# EAGLE design HelpfulHallway (EAGLE 9.5.0)
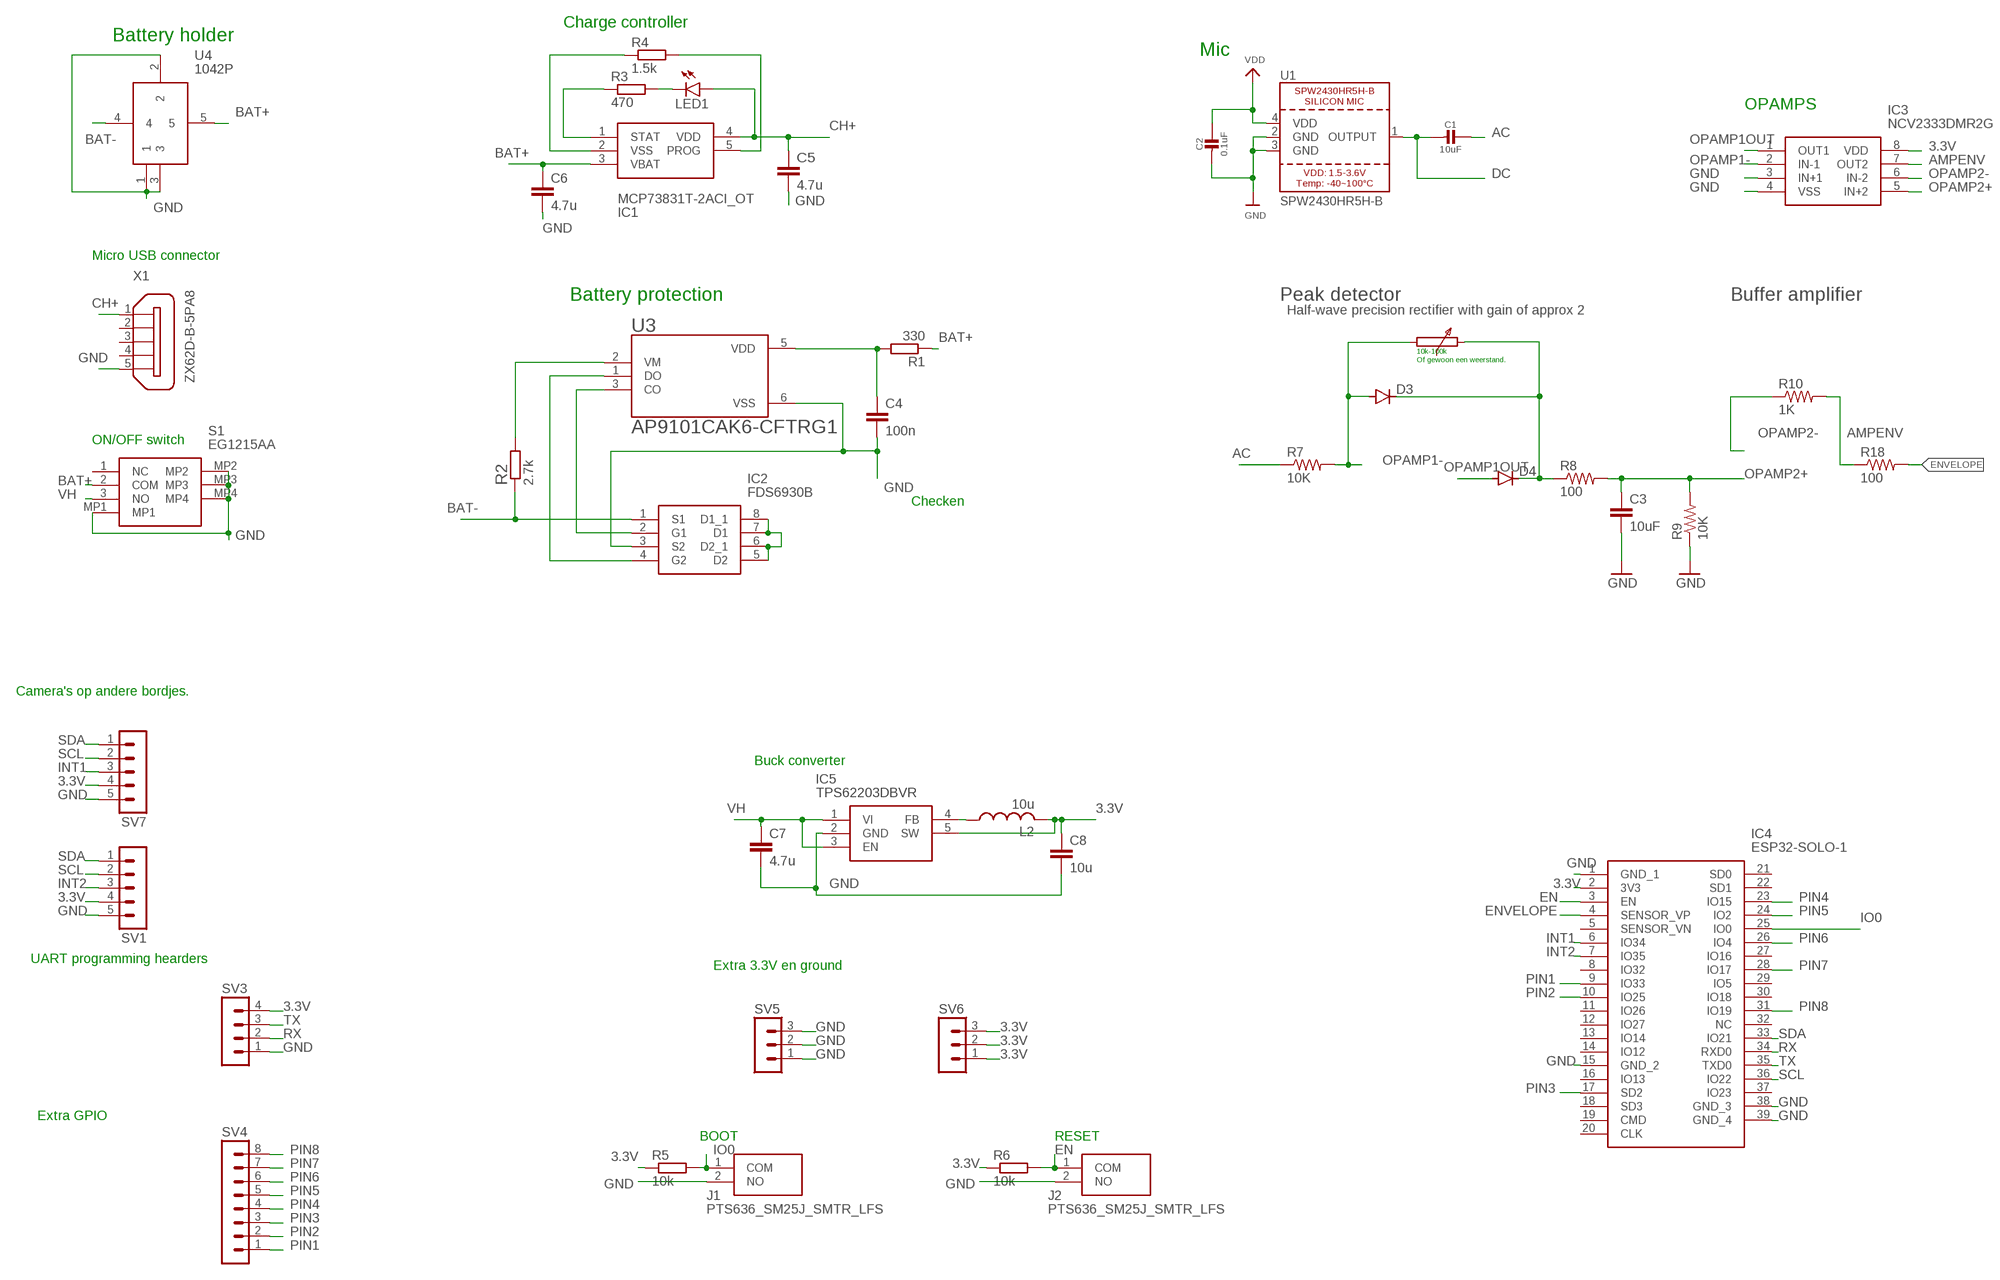
[diagram p0: schematic, sheet 1]

## Parts
C1  10uF  CAP_CERAMIC0805-NOOUTLINE  [0805-NO]
C2  0.1uF  CAP_CERAMIC0805-NOOUTLINE  [0805-NO]
C3  10uF  10UF-6.3V-20%(1206)  [1206]
C4  100n  C-EUC1206  [C1206]
C5  4.7u  C-EUC1206  [C1206]
C6  4.7u  C-EUC1206  [C1206]
C7  4.7u  C-EUC1206  [C1206]
C8  10u  C-EUC1206  [C1206]
D3  DIODE-SOD123  [SOD123]
D4  DIODE-SOD123  [SOD123]
IC1  MCP73831T-2ACI_OT  [SOT95P270X145-5N]
IC2  FDS6930B  [SOIC127P600X175-8N]
IC3  NCV2333DMR2G  [SOP65P490X110-8N]
IC4  ESP32-SOLO-1  [ESP32SOLO1]
IC5  TPS62203DBVR  [SOT95P280X145-5N]
J1  PTS636_SM25J_SMTR_LFS  [PTS636SM25JSMTRLFS]
J2  PTS636_SM25J_SMTR_LFS  [PTS636SM25JSMTRLFS]
L2  10u  L-USL4532P  [L4532P]
LED1  LEDSMT1206  [1206]
R1  330  R-EU_R1206  [R1206]
R2  2.7k  R-EU_R1206  [R1206]
R3  470  R-EU_R1206  [R1206]
R4  1.5k  R-EU_R1206  [R1206]
R5  10k  R-EU_M1206  [M1206]
R6  10k  R-EU_M1206  [M1206]
R7  10K  10KOHM1/10W1%(0603)0603  [0603-RES]
R8  100  100OHM1/10W1%(0603)  [0603-RES]
R9  10K  10KOHM1/10W1%(0603)0603  [0603-RES]
R10  1K  1KOHM1/10W1%(0603)  [0603-RES]
R18  100  100OHM1/10W1%(0603)  [0603-RES]
S1  EG1215AA  [EG1215AA]
SV1  MA05-1  [MA05-1]
SV3  MA04-1  [MA04-1]
SV4  MA08-1  [MA08-1]
SV5  MA03-1  [MA03-1]
SV6  MA03-1  [MA03-1]
SV7  MA05-1  [MA05-1]
U1  SPW2430HR5H-B  [SPW2430HR5H-B]
U3  AP9101CAK6-CFTRG1  [SOT95P280X140-6N]
U4  1042P  [1042P]
X1  ZX62D-B-5PA8  [ZX62D-B-5PA8]

## Nets
3.3V: C8.1 IC3.8(VDD) IC4.2(3V3) IC5.5(SW) L2.2 R5.1 R6.1 SV1.4 SV3.4 SV6.1 SV6.2 SV6.3 SV7.4
AC: C1.1 R7.1
AMPENV: IC3.7(OUT2) R10.2 R18.1
BAT+: C6.1 IC1.3(VBAT) R1.1 S1.2(COM) U4.5
BAT-: IC2.1(S1) R2.1 U4.4
CH+: C5.1 IC1.4(VDD) LED1.A X1.1
DC: C1.2 U1.1(OUTPUT)
EN: IC4.3(EN) J2.1(COM) R6.2
ENVELOPE: IC4.4(SENSOR_VP) R18.2
GND: C2.2 C3.2 C4.2 C5.2 C6.2 C7.2 C8.2 IC2.3(S2) IC3.3(IN+1) IC3.4(VSS) IC4.1(GND_1) IC4.15(GND_2) IC4.38(GND_3) IC4.39(GND_4) IC5.2(GND) J1.2(NO) J2.2(NO) R9.1 S1.MP1 S1.MP2 S1.MP3 S1.MP4 SV1.5 SV3.1 SV5.1 SV5.2 SV5.3 SV7.5 U1.2(GND) U1.3(GND) U3.6(VSS) U4.1 U4.2 U4.3 X1.5
INT1: IC4.6(IO34) SV7.3
INT2: IC4.7(IO35) SV1.3
IO0: IC4.25(IO0) J1.1(COM) R5.2
N$1: R2.2 U3.2(VM)
N$4: IC2.5(D2) IC2.6(D2_1) IC2.7(D1) IC2.8(D1_1)
N$5: IC2.4(G2) U3.1(DO)
N$6: IC2.2(G1) U3.3(CO)
N$9: LED1.C R3.2
N$10: C4.1 R1.2 U3.5(VDD)
N$11: D3.C D4.C R8.1
N$12: IC1.1(STAT) R3.1
N$14: IC5.4(FB) L2.1
N$17: IC1.5(PROG) R4.2
N$18: IC1.2(VSS) R4.1
OPAMP1-: D3.A IC3.2(IN-1) R7.2
OPAMP1OUT: D4.A IC3.1(OUT1)
OPAMP2+: C3.1 IC3.5(IN+2) R8.2 R9.2
OPAMP2-: IC3.6(IN-2) R10.1
PIN1: IC4.9(IO33) SV4.1
PIN2: IC4.10(IO25) SV4.2
PIN3: IC4.17(SD2) SV4.3
PIN4: IC4.23(IO15) SV4.4
PIN5: IC4.24(IO2) SV4.5
PIN6: IC4.26(IO4) SV4.6
PIN7: IC4.28(IO17) SV4.7
PIN8: IC4.31(IO19) SV4.8
RX: IC4.34(RXD0) SV3.2
SCL: IC4.36(IO22) SV1.2 SV7.2
SDA: IC4.33(IO21) SV1.1 SV7.1
TX: IC4.35(TXD0) SV3.3
VDD: C2.1 U1.4(VDD)
VH: C7.1 IC5.1(VI) IC5.3(EN) S1.3(NO)
Unconnected: IC4.5(SENSOR_VN) IC4.8(IO32) IC4.11(IO26) IC4.12(IO27) IC4.13(IO14) IC4.14(IO12) IC4.16(IO13) IC4.18(SD3) IC4.19(CMD) IC4.20(CLK) IC4.21(SD0) IC4.22(SD1) IC4.27(IO16) IC4.29(IO5) IC4.30(IO18) IC4.32(NC) IC4.37(IO23) S1.1(NC) X1.2 X1.3 X1.4 X1.S1 X1.S2 X1.S3 X1.S4

## Notes on the sheet
- Charge controller
- Battery holder
- Mic
- OPAMPS
- Micro USB connector
- Battery protection | Peak detector | Buffer amplifier
- Half-wave precision rectifier with gain of approx 2
- 10k-100k
  Of gewoon een weerstand.
- ON/OFF switch
- Checken
- Camera's op andere bordjes.
- Buck converter
- UART programming hearders
- Extra 3.3V en ground
- Extra GPIO
- BOOT | RESET

## Library data of the parts
C1 C2 = microbuilder:CAP_CERAMIC: Ceramic Capacitors For new designs, use the packages preceded by an '_' character since they are more reliable: The following footprints should be used on most boards: _0402 - Standard footprint for regular board layouts _0603 - Standard footprint for regular board layouts _0805 - Standard footprint for regular board layouts _1206 - Standard footprint for regular board layouts For extremely tight-pitch boards where space is at a premium, the following 'micro-pitch' footprints can be used (smaller pads, no silkscreen outline, etc.): _0402MP - Micro-pitch footprint for very dense/compact boards _0603MP - Micro-pitch footprint for very dense/compact boards _0805MP - Micro-pitch footprint for very dense/compact boards _1206MP - Micro-pitch footprint for very dense/compact boards
C3 = SparkFun-Capacitors:10UF-6.3V-20%(1206): Ceramic CAP-10057; PROD_ID: CAP-10057
C4-C8 = rcl:C-EU: CAPACITOR, European symbol; SPICEPREFIX: C
D3 D4 = diode:DIODE-: DIODE
IC1 = SamacSys_Parts:MCP73831T-2ACI_OT: Li-Ion Charge Controller 4.2V SOT23-5 Source: Datasheet <https://componentsearchengine.com/Datasheets/1/MCP73831T-2ACI_OT.pdf>; DESCRIPTION: Li-Ion Charge Controller 4.2V SOT23-5; HEIGHT: 1.45mm; MANUFACTURER_NAME: Microchip; MANUFACTURER_PART_NUMBER: MCP73831T-2ACI/OT; MOUSER_PART_NUMBER: 579-MCP73831T-2ACIOT; MOUSER_PRICE-STOCK: https://www.mouser.com/Search/Refine.aspx?Keyword=579-MCP73831T-2ACIOT
IC2 = SamacSys_Parts:FDS6930B: FDS6930B, Dual N-channel MOSFET Transistor 5.5A 30V, 8-Pin SOIC Source: Datasheet <https://componentsearchengine.com/Datasheets/1/FDS6930B.pdf>; DESCRIPTION: FDS6930B, Dual N-channel MOSFET Transistor 5.5A 30V, 8-Pin SOIC; HEIGHT: 1.75mm; MANUFACTURER_NAME: ON Semiconductor; MANUFACTURER_PART_NUMBER: FDS6930B; MOUSER_PART_NUMBER: 512-FDS6930B; MOUSER_PRICE-STOCK: https://www.mouser.com/Search/Refine.aspx?Keyword=512-FDS6930B
IC3 = SamacSys_Parts:NCV2333DMR2G: DUAL PRECISION OP-AMP Source: Datasheet <https://componentsearchengine.com/Datasheets/1/NCV2333DMR2G.pdf>; DESCRIPTION: DUAL PRECISION OP-AMP; HEIGHT: 1.1mm; MANUFACTURER_NAME: ON Semiconductor; MANUFACTURER_PART_NUMBER: NCV2333DMR2G; MOUSER_PART_NUMBER: 863-NCV2333DMR2G; MOUSER_PRICE-STOCK: https://www.mouser.com/Search/Refine.aspx?Keyword=863-NCV2333DMR2G
IC4 = SamacSys_Parts:ESP32-SOLO-1: WiFi Modules (802.11) SMD Module, ESP32-S0WD, 32Mbits SPI flash, UART mode, Source: Datasheet <https://componentsearchengine.com/Datasheets/1/ESP32-SOLO-1.pdf>; DESCRIPTION: WiFi Modules (802.11) SMD Module, ESP32-S0WD, 32Mbits SPI flash, UART mode,; HEIGHT: mm; MANUFACTURER_NAME: Espressif Systems; MANUFACTURER_PART_NUMBER: ESP32-SOLO-1; MOUSER_PART_NUMBER: 356-ESP32-SOLO-1; MOUSER_PRICE-STOCK: https://www.mouser.com/Search/Refine.aspx?Keyword=356-ESP32-SOLO-1
IC5 = SamacSys_Parts:TPS62203DBVR: 3.3-V Output, 300-mA, 95% Efficient Step-Down Converter in SOT-23 Source: Datasheet <http://www.ti.com/lit/ds/symlink/tps62203.pdf>; DESCRIPTION: 3.3-V Output, 300-mA, 95% Efficient Step-Down Converter in SOT-23; HEIGHT: 1.45mm; MANUFACTURER_NAME: Texas Instruments; MANUFACTURER_PART_NUMBER: TPS62203DBVR; MOUSER_PART_NUMBER: 595-TPS62203DBVR; MOUSER_PRICE-STOCK: https://www.mouser.com/Search/Refine.aspx?Keyword=595-TPS62203DBVR
J1 J2 = SamacSys_Parts:PTS636_SM25J_SMTR_LFS: Tactile Switches Tact 50mA 12VDC, 6.0x3.5, 2.5mm H, 180gf, J leads, No ground pin, White Actuator Source: Datasheet <https://componentsearchengine.com/Datasheets/1/PTS636 SM25J SMTR LFS.pdf>; DESCRIPTION: Tactile Switches Tact 50mA 12VDC, 6.0x3.5, 2.5mm H, 180gf, J leads, No ground pin, White Actuator; HEIGHT: 2.7mm; MANUFACTURER_NAME: C & K COMPONENTS; MANUFACTURER_PART_NUMBER: PTS636 SM25J SMTR LFS; MOUSER_PART_NUMBER: 611-PTS636SM25JSMTRL; MOUSER_PRICE-STOCK: https://www.mouser.com/Search/Refine.aspx?Keyword=611-PTS636SM25JSMTRL
L2 = rcl:L-US: INDUCTOR, American symbol; SPICEPREFIX: L
LED1 = led:LED: LED OSRAM: - CHIPLED LG R971, LG N971, LY N971, LG Q971, LY Q971, LO R971, LY R971 LH N974, LH R974 LS Q976, LO Q976, LY Q976 LO Q996 - Hyper CHIPLED LW Q18S LB Q993, LB Q99A, LB R99A - SideLED LS A670, LO A670, LY A670, LG A670, LP A670 LB A673, LV A673, LT A673, LW A673 LH A674 LY A675 LS A676, LA A676, LO A676, LY A676, LW A676 LS A679, LY A679, LG A679 - Hyper Micro SIDELED® LS Y876, LA Y876, LO Y876, LY Y876 LT Y87S - SmartLED LW L88C, LW L88S LB L89C, LB L89S, LG L890 LS L89K, LO L89K, LY L89K LS L896, LA L896, LO L896, LY L896 - TOPLED LS T670, LO T670, LY T670, LG T670, LP T670 LSG T670, LSP T670, LSY T670, LOP T670, LYG T670 LG T671, LOG T671, LSG T671 LB T673, LV T673, LT T673, LW T673 LH T674 LS T676, LA T676, LO T676, LY T676, LB T676, LH T676, LSB T676, LW T676 LB T67C, LV T67C, LT T67C, LS T67K, LO T67K, LY T67K, LW E67C LS E67B, LA E67B, LO E67B, LY E67B, LB E67C, LV E67C, LT E67C LW T67C LS T679, LY T679, LG T679 LS T770, LO T770, LY T770, LG T770, LP T770 LB T773, LV T773, LT T773, LW T773 LH T774 LS E675, LA E675, LY E675, LS T675 LS T776, LA T776, LO T776, LY T776, LB T776 LHGB T686 LT T68C, LB T68C - Hyper Mini TOPLED® LB M676 - Mini TOPLED Santana® LG M470 LS M47K, LO M47K, LY M47K Source: http://www.osram.convergy.de LUXEON: - LUMILED® LXK2-PW12-R00, LXK2-PW12-S00, LXK2-PW14-U00, LXK2-PW14-V00 LXK2-PM12-R00, LXK2-PM12-S00, LXK2-PM14-U00 LXK2-PE12-Q00, LXK2-PE12-R00, LXK2-PE12-S00, LXK2-PE14-T00, LXK2-PE14-U00 LXK2-PB12-K00, LXK2-PB12-L00, LXK2-PB12-M00, LXK2-PB14-N00, LXK2-PB14-P00, LXK2-PB14-Q00 LXK2-PR12-L00, LXK2-PR12-M00, LXK2-PR14-Q00, LXK2-PR14-R00 LXK2-PD12-Q00, LXK2-PD12-R00, LXK2-PD12-S00 LXK2-PH12-R00, LXK2-PH12-S00 LXK2-PL12-P00, LXK2-PL12-Q00, LXK2-PL12-R00 Source: www.luxeon.com KINGBRIGHT: KA-3528ASYC Source: www.kingbright.com
R1-R3 = resistor:R-EU_: RESISTOR, European symbol
R4-R6 = rcl:R-EU_: RESISTOR, European symbol; SPICEPREFIX: R
R7 R9 = SparkFun-Resistors:10KOHM1/10W1%(0603): RES-00824; PROD_ID: RES-00824
R8 R18 = SparkFun-Resistors:100OHM1/10W1%(0603): RES-07863; PROD_ID: RES-07863
R10 = SparkFun-Resistors:1KOHM1/10W1%(0603): RES-07856; PROD_ID: RES-07856
S1 = SamacSys_Parts:EG1215AA: E-SWITCH - EG1215AA - SLIDE SWITCH, SPDT, 0.025A, 24V, SMD Source: Datasheet <https://componentsearchengine.com/Datasheets/1/EG1215AA.pdf>; DESCRIPTION: E-SWITCH - EG1215AA - SLIDE SWITCH, SPDT, 0.025A, 24V, SMD; HEIGHT: 1.4mm; MANUFACTURER_NAME: E-Switch; MANUFACTURER_PART_NUMBER: EG1215AA; MOUSER_PART_NUMBER: 612-EG1215AA; MOUSER_PRICE-STOCK: https://www.mouser.com/Search/Refine.aspx?Keyword=612-EG1215AA
SV1 SV7 = con-lstb:MA05-1: PIN HEADER; OC_FARNELL: unknown; OC_NEWARK: unknown
SV3 = con-lstb:MA04-1: PIN HEADER; OC_FARNELL: unknown; OC_NEWARK: unknown
SV4 = con-lstb:MA08-1: PIN HEADER; OC_FARNELL: unknown; OC_NEWARK: unknown
SV5 SV6 = con-lstb:MA03-1: PIN HEADER; OC_FARNELL: unknown; OC_NEWARK: unknown
U1 = microbuilder:SPW2430HR5H-B: SPW2430HR5H-B - Silicon Microphone
U3 = AP9101CAK6-CFTRG1:AP9101CAK6-CFTRG1: Ic Batt Prot Li-Ion 1-Cell Sot26; AVAILABILITY: Unavailable; DESCRIPTION: Battery Battery Protection IC Lithium Ion/Polymer SOT-26; MF: Diodes Inc.; MP: AP9101CAK6-CFTRG1; PACKAGE: SOT-23 Diodes Inc.; PRICE: None
U4 = SamacSys_Parts:1042P: KEYSTONE - 1042P - BATTERY HOLDER, 18650, SMD Source: Datasheet <https://componentsearchengine.com/Datasheets/1/1042P.pdf>; DESCRIPTION: KEYSTONE - 1042P - BATTERY HOLDER, 18650, SMD; HEIGHT: 14mm; MANUFACTURER_NAME: Keystone Electronics; MANUFACTURER_PART_NUMBER: 1042P; MOUSER_PART_NUMBER: 534-1042P; MOUSER_PRICE-STOCK: https://www.mouser.com/Search/Refine.aspx?Keyword=534-1042P
X1 = ZX62D-B-5PA8:ZX62D-B-5PA8: Micro USB Type B Connector - Standard, Shell Through Hole Source: http://www.hirose.co.jp/cataloge_hp/ed_ZX_20140804.pdf; AVAILABILITY: Unavailable; DESCRIPTION: USB - micro B USB 2.0 Receptacle Connector 5 Position Surface Mount, Right Angle; Through Hole; MF: Hirose; MP: ZX62D-B-5PA8; PACKAGE: None; PRICE: None

## Board
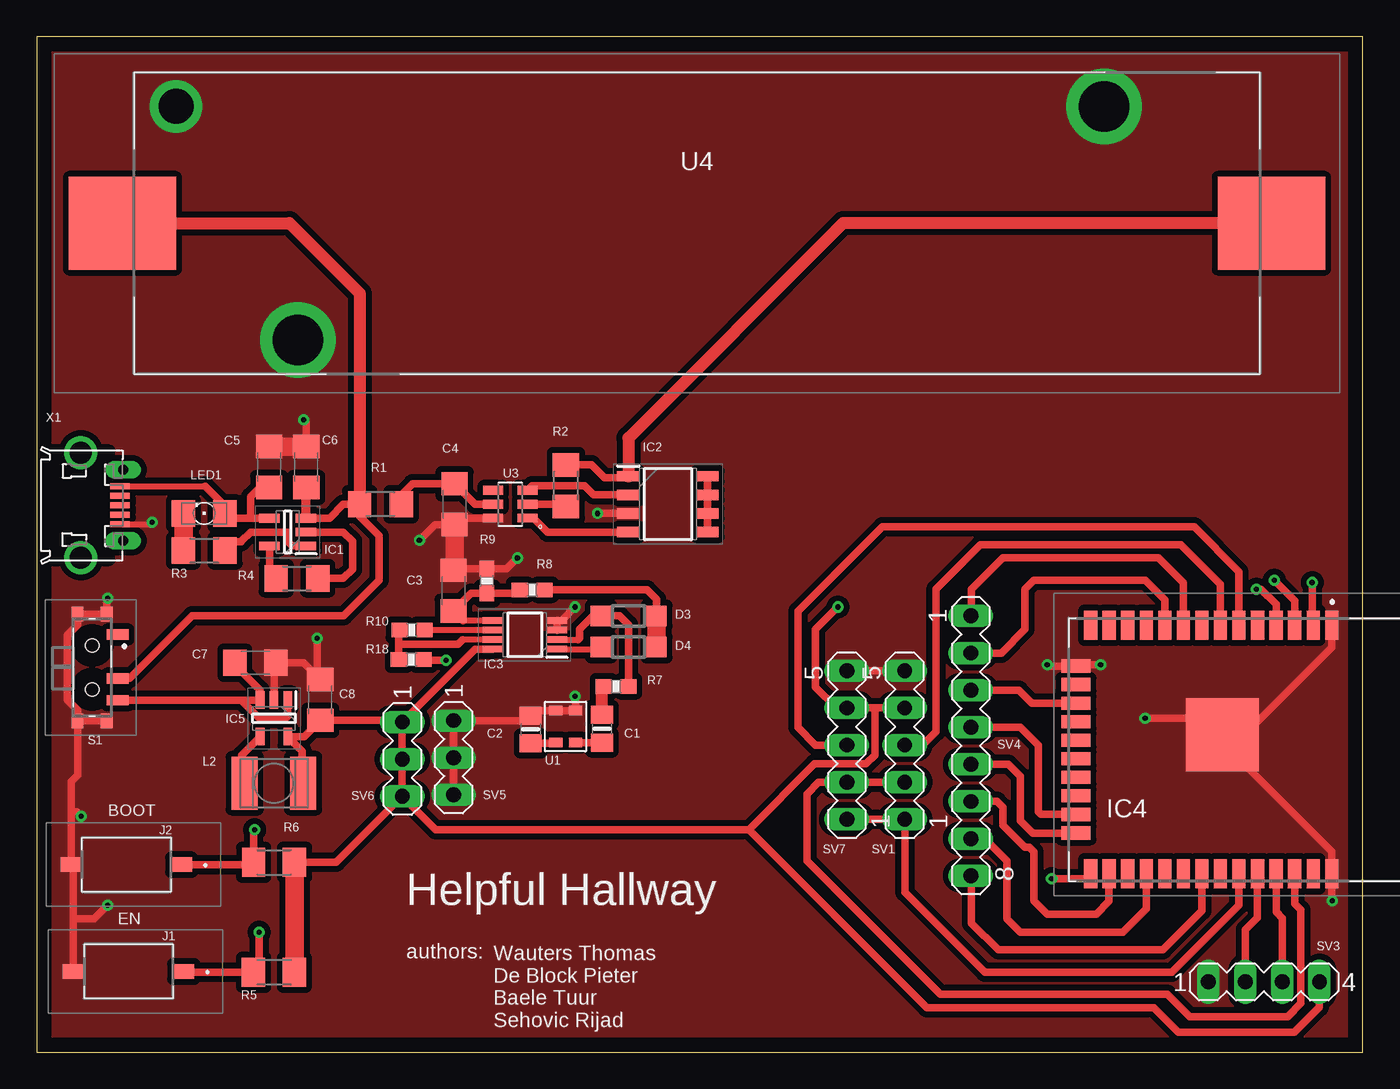
[diagram p1: board, top side]
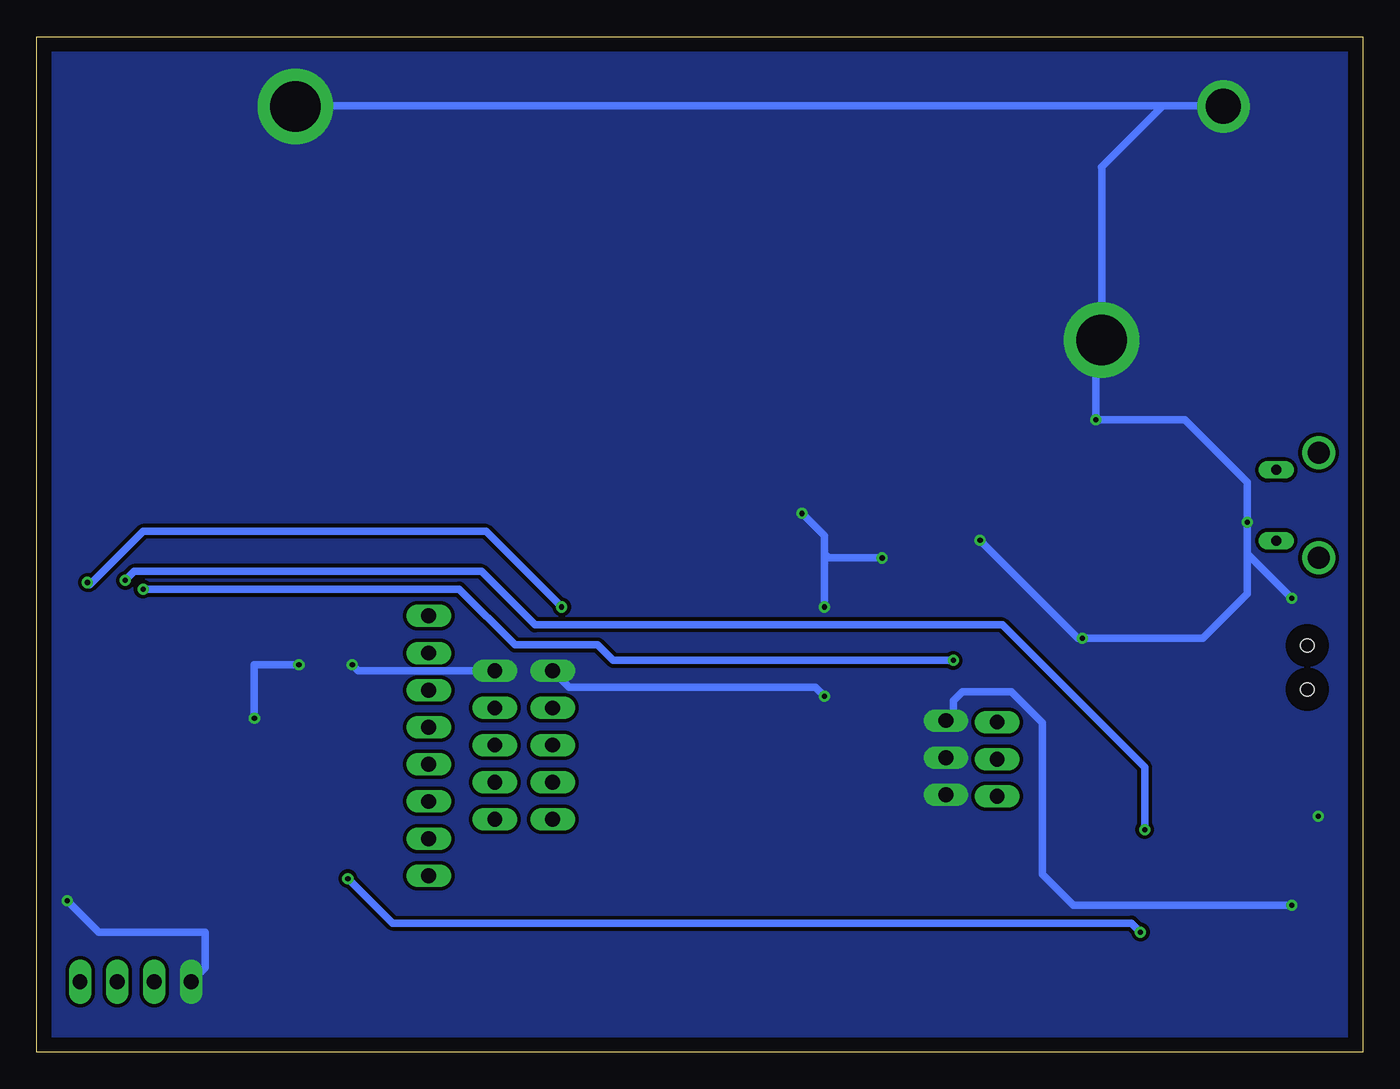
[diagram p2: board, bottom side, seen from below]

Size 90.81 x 69.52 mm. Coordinates in mm from the lower left corner, seen from the top.
Outline: 0,0 90.81,0 90.81,69.52 0,69.52 0,0
Copper layers (1*16): Top 0.035mm / dielectric 1.5mm / Bottom 0.035mm
Design rules "default *": minimum track width 6mil, minimum drill 0.35mm, track to track 6mil, track to pad 6mil, pad to pad 6mil, via to via 6mil, smd to smd 6mil, copper to edge 40mil, drill to drill 6mil, minimum pad ring 10mil, minimum via ring 8mil, stop-mask expansion 4mil, vias tented up to drill 0mil, thermal gap 10mil

### Footprints (pad centres in the part's own frame; a part is rotated, then mirrored left to right if it is on the bottom)
0805-NO = smd 1.24 x 1.5: 1 -0.95,0; 2 0.95,0
1206 = smd 1.6 x 1.8: 1 -1.4,0; 2 1.4,0
C1206 = smd 1.6 x 1.8: 1 -1.4,0; 2 1.4,0
SOD123 = smd 1.4 x 1.4: A 1.9,0; C -1.9,0
SOT95P270X145-5N = smd 1.4 x 0.6: 1 -1.25,0.95; 2 -1.25,0; 3 -1.25,-0.95; 4 1.25,-0.95; 5 1.25,0.95
SOIC127P600X175-8N = smd 1.525 x 0.7: 1 -2.712,1.905; 2 -2.712,0.635; 3 -2.712,-0.635; 4 -2.712,-1.905; 5 2.712,-1.905; 6 2.712,-0.635; 7 2.712,0.635; 8 2.712,1.905
SOP65P490X110-8N = smd 1.4 x 0.45: 1 -2.2,0.975; 2 -2.2,0.325; 3 -2.2,-0.325; 4 -2.2,-0.975; 5 2.2,-0.975; 6 2.2,-0.325; 7 2.2,0.325; 8 2.2,0.975
ESP32SOLO1 = smd 2 x 0.9: 1 -8.5,5.51; 2 -8.5,4.24; 3 -8.5,2.97; 4 -8.5,1.7; 5 -8.5,0.43; 6 -8.5,-0.84; 7 -8.5,-2.11; 8 -8.5,-3.38; 9 -8.5,-4.65; 10 -8.5,-5.92; 11 -8.5,-7.19; 12 -8.5,-8.46; 13 -8.5,-9.73; 14 -8.5,-11; 25 8.5,-11; 26 8.5,-9.73; 27 8.5,-8.46; 28 8.5,-7.19; 29 8.5,-5.92; 30 8.5,-4.65; 31 8.5,-3.38; 32 8.5,-2.11; 33 8.5,-0.84; 34 8.5,0.43; 35 8.5,1.7; 36 8.5,2.97; 37 8.5,4.24; 38 8.5,5.51 | smd 0.9 x 2: 15 -5.715,-12; 16 -4.445,-12; 17 -3.175,-12; 18 -1.905,-12; 19 -0.635,-12; 20 0.635,-12; 21 1.905,-12; 22 3.175,-12; 23 4.445,-12; 24 5.715,-12 | smd 5 x 5: 39 -1,-1.99
SOT95P280X145-5N = smd 1.2 x 0.6: 1 -1.25,0.95; 2 -1.25,0; 3 -1.25,-0.95; 4 1.25,-0.95; 5 1.25,0.95
PTS636SM25JSMTRLFS = smd 1.45 x 1: 1 -3.775,0; 2 3.775,0
L4532P = smd 1.8 x 3.6: 1 -2,0; 2 2,0
1206' = smd 1.6 x 1.803: A -1.422,0; C 1.422,0
R1206 = smd 1.6 x 1.803: 1 -1.422,0; 2 1.422,0
M1206 = smd 1.6 x 2: 1 -1.4,0; 2 1.4,0
0603-RES = smd 1.1 x 1: 1 -0.85,0; 2 0.85,0
EG1215AA = smd 0.7 x 1.5: 1 -2.25,1.75; 2 0.75,1.75; 3 2.25,1.75 | smd 1 x 0.8: MP1 -3.65,1; MP2 3.65,1; MP3 -3.65,-1; MP4 3.65,-1 | hole 0.9: -1.5,0; 1.5,0
MA05-1 = drill 1.016 long: 1 -5.08,0; 2 -2.54,0; 3 0,0; 4 2.54,0; 5 5.08,0
MA04-1 = drill 1.016 long: 1 -3.81,0; 2 -1.27,0; 3 1.27,0; 4 3.81,0
MA08-1 = drill 1.016 long: 1 -8.89,0; 2 -6.35,0; 3 -3.81,0; 4 -1.27,0; 5 1.27,0; 6 3.81,0; 7 6.35,0; 8 8.89,0
MA03-1 = drill 1.016 long: 1 -2.54,0; 2 0,0; 3 2.54,0
SPW2430HR5H-B = smd 0.9 x 0.66: 1 -0.675,1.095; 2 -0.675,-1.095; 3 0.675,-1.095; 4 0.675,1.095
SOT95P280X140-6N = smd 1.35 x 0.6: 1 -1.185,0.95; 2 -1.185,0; 3 -1.185,-0.95; 4 1.185,-0.95; 5 1.185,0; 6 1.185,0.95
1042P = drill 3.45 pad 5.175: 1 -27.87,-8; 2 27.33,8 | drill 2.39 pad 3.585: 3 35.66,-8 | smd 7.34 x 6.35: 4 -39.33,0; 5 39.33,0
ZX62D-B-5PA8 = smd 1.35 x 0.4: 1 4.825,1.3; 2 4.825,0.65; 3 4.825,0; 4 4.825,-0.65; 5 4.825,-1.3 | drill 1.5: S1 2.15,-3.6; S2 2.15,3.6 | drill 0.7 long: S3 5.05,2.425; S4 5.05,-2.425

### Placement (x,y rotation side)
C1  38.71,22.15 270 top
C2  33.83,22.1 90 top
C3  28.55,31.6 90 top
C4  28.63,37.52 270 top
C5  15.93,40.06 90 top
C6  18.47,40.06 90 top
C7  14.99,26.67 0 top
C8  19.43,24.13 90 top
D3  40.54,29.87 180 top
D4  40.54,27.74 180 top
IC1  17.2,35.61 180 top
IC2  43.23,37.52 0 top
IC3  33.43,28.57 180 top
IC4  83.16,20.73 270 top
IC5  16.26,22.86 270 top
J1  6.3,5.54 180 top
J2  6.16,12.85 180 top
L2  16.26,18.41 0 top
LED1  [1206']  11.48,36.88 180 top
R1  23.55,37.52 0 top
R2  36.25,38.79 270 top
R3  11.48,34.34 180 top
R4  17.83,32.44 180 top
R5  16.26,5.49 180 top
R6  16.26,13 180 top
R7  39.67,25.04 0 top
R8  33.93,31.65 180 top
R9  30.84,32.26 270 top
R10  25.7,28.91 180 top
R18  25.65,26.87 0 top
S1  3.81,26.34 270 top
SV1  59.44,21.03 90 top
SV3  84.02,4.83 0 top
SV4  63.96,20.98 270 top
SV5  28.55,20.17 270 top
SV6  25.04,20.07 270 top
SV7  55.47,21.03 90 top
U1  36.22,22.3 180 top
U3  32.44,37.52 180 top
U4  45.21,56.74 180 top
X1  0.89,37.44 0 top

### Tracks (layer width: path | path; a pad name or v marks a point on that pad's centre or on a via)
3.3V  (via drill 0.35)
  Top 0.508: L2.2 18.2,20.62 IC5.5 18.31,21.61 C8.1 24.92,22.73 SV6.1 | SV6.1 SV6.3 | 57.3,23.57 SV7.4 54.76,23.57 53.34,24.99 53.34,28.96 v54.86,30.48 | 57.3,23.57 SV1.4 | 17.66,5.48 R5.1 | SV6.1 30.04,27.6 IC3.8 | SV6.3 20.52,13.01 R6.1 | 57.3,23.57 57.4,23.47 57.4,20.55 57.39,20.53 57.39,20.34 56.79,19.74 53.27,19.74 48.77,15.24 | v87.33,32.16 87.33,29.3 IC4.2 | SV6.2 SV6.1 | SV3.4 87.83,3.1 86.12,1.39 78.16,1.39 76.5,3.05 60.96,3.05 48.77,15.24 | SV6.3 27.33,15.24 48.77,15.24
  Top 1.27: R6.1 17.66,5.48
  Bottom 0.508: v87.33,32.16 87.17,32 83.52,35.66 60.05,35.66 v54.86,30.48
AC
  Top 0.508: 38.71,24.93 R7.1
  Top 0.813: C1.1 38.71,24.93
AMPENV
  Top 0.406: IC3.7 29.16,28.25
  Top 0.508: R18.1 24.8,27.93 | 24.8,27.93 24.8,28.85 R10.2 | 24.8,27.93 28.85,27.93 29.16,28.25
BAT+
  Top 0.508: 18.47,36.58 IC1.3 20.05,36.56 21.01,37.52 R1.1 22.12,36.7 23.47,35.36 23.47,32.31 21.03,29.87 10.67,29.87 6.39,25.59 S1.2 | U4.5 6.1,56.96 6.1,57
  Top 0.61: 18.47,36.58 C6.1
  Top 0.813: U4.5 17.32,56.74 22.12,51.94 R1.1
BAT-
  Top 0.508: R2.1 38,40.21 38.89,39.32 40.62,39.32 IC2.1
  Top 0.813: U4.4 55.22,56.74 40.52,42.04 IC2.1
CH+
  Top 0.406: X1.1 11.55,38.74
  Top 0.508: IC1.4 14.66,36.56 | 14.66,36.56 13.22,36.56 LED1.A 12.9,37.39 11.55,38.74 | C5.1 15.29,38.66 14.66,38.02 14.66,36.56
DC
  Top 0.508: U1.1 C1.2
EN  (via drill 0.35)
  Top 0.508: J2.1 14.71,12.85 R6.2 14.87,15.17 v14.94,15.24 | v84.73,32.31 86.13,30.91 IC4.3
  Bottom 0.508: v14.94,15.24 14.94,19.51 24.69,29.26 56.69,29.26 60.35,32.92 84.12,32.92 v84.73,32.31
ENVELOPE  (via drill 0.35)
  Top 0.508: IC4.4 84.86,30.66 83.82,31.7 v83.52,31.7 | v28.04,26.82 26.55,26.82 R18.2
  Bottom 0.508: v83.52,31.7 61.87,31.7 58.06,27.89 52.4,27.89 51.33,26.82 v28.04,26.82
GND  (via drill 0.35)
  Top 0.406: X1.5 7.79,36.14
  Top 0.508: 16.26,26.54 16.26,26.61 16.46,26.61 16.26,26.4 | U3.6 29.08,36.57 C4.2 27.28,36.12 v26.21,35.05 | SV7.5 SV1.5 | 2.52,9.14 2.52,12.71 J2.2 2.38,16.46 | 2.52,9.14 J1.2 | v72.85,26.52 71.24,26.52 IC4.15 69.27,26.44 v69.19,26.52 | v18.29,43.28 18.47,43.1 C6.2 | 7.79,36.14 v7.92,36.27 | S1.MP2 S1.MP4 | S1.MP4 2.81,23.41 2.09,24.13 2.09,28.55 2.81,29.27 S1.MP3 S1.MP1 4.81,31.02 v4.88,31.09 | S1.MP4 2.81,18.96 2.38,18.54 2.38,16.46 | 2.38,16.46 2.74,16.46 v3.05,16.15 | v19.2,28.35 19.2,25.76 C8.2 18.29,26.67 C7.2 16.26,26.54 | v4.88,10.06 3.96,9.14 2.52,9.14 | IC2.3 v38.41,36.88 | v36.88,30.48 35.95,29.55 IC3.4 | v32.92,33.83 32.19,33.11 R9.1 28.66,33.11 C3.2 28.63,33.07 | v36.88,24.38 36.9,24.37 U1.2 U1.3 34.18,23.4 C2.2 33.49,22.71 SV5.1 SV5.2 SV5.3 | IC3.4 IC3.3 | IC3.4 35.65,29.55 35.66,29.57 | 82.91,19.51 88.67,13.74 IC4.38 88.67,10.39 v88.7,10.36 | 82.91,19.51 81.38,21.03 | IC4.1 88.67,27.71 82.69,21.73 IC4.39 | v75.89,22.86 80.04,22.86 IC4.39 | IC4.39 82.91,19.99 82.91,19.51 | 16.26,26.4 16.26,26.54 | IC5.2 16.26,26.4
  Top 1.27: C6.2 C5.2 | C4.2 28.63,33.07
  Bottom 0.508: v72.85,26.52 75.89,26.52 v75.89,22.86 | 13.72,64.77 17.91,60.58 17.88,60.55 U4.2 18.29,48.34 v18.29,43.28 12.19,43.28 7.92,39.01 v7.92,36.27 7.92,34.14 | 13.72,64.77 9.58,64.77 U4.3 | 13.72,64.77 73.06,64.77 U4.1 | v4.88,31.09 7.92,34.14 | 7.92,34.14 7.92,31.39 10.97,28.35 v19.2,28.35 19.51,28.35 v26.21,35.05 | SV5.1 28.04,23.22 28.04,24.08 27.43,24.69 24.08,24.69 21.95,22.55 21.95,12.19 19.81,10.06 v4.88,10.06 | v38.41,36.88 36.88,35.36 36.88,34.14 | 36.88,34.14 v36.88,30.48 | 36.88,34.14 36.58,33.83 v32.92,33.83 | v69.19,26.52 68.78,26.11 SV1.5 | SV7.5 54.36,24.99 37.49,24.99 v36.88,24.38 | v88.7,10.36 86.56,8.23 79.25,8.23 79.25,5.79 SV3.1
  pour Bottom (isolate 0.254, no thermals): 0,69.49 90.83,69.49 90.83,0 0,0
  pour Top (isolate 0.406, no thermals): 0,0 0,69.49 90.83,69.49 90.83,0
INT1
  Top 0.508: SV7.3 53.34,21.03 52.12,22.25 52.12,30.18 57.91,35.97 79.25,35.97 82.32,32.9 IC4.6
INT2
  Top 0.508: SV1.3 60.66,21.03 61.57,21.95 61.57,31.7 64.62,34.75 78.33,34.75 81.05,32.03 IC4.7
IO0  (via drill 0.35)
  Top 0.508: J1.1 10.12,5.49 R5.2 15.24,5.87 v15.24,8.23 | IC4.25 71.82,11.89 v69.49,11.89
  Bottom 0.508: v69.49,11.89 66.45,8.84 15.85,8.84 v15.24,8.23
N$1
  Top 0.508: U3.2 35.97,37.52 36.12,37.36 R2.2
N$4
  Top 0.508: IC2.5 IC2.6 IC2.7 IC2.8
N$5
  Top 0.508: IC2.4 34.98,35.61 34.02,36.57 U3.1
N$6
  Top 0.508: U3.3 33.94,38.79 37.52,38.79 38.15,38.15 IC2.2
N$9
  Top 1.27: R3.2 LED1.C
N$10
  Top 0.508: R1.2 24.97,38.12 25.76,38.92 C4.1 30.03,37.52 U3.5
N$11
  Top 0.508: D3.C 42.44,31.02 41.81,31.65 R8.1
  Top 1.27: D4.C D3.C
N$12
  Top 0.508: IC1.1 17.51,34.66 17.2,34.98 17.2,35.61 14.66,35.61 14.02,34.98 14.02,34.95 13.51,34.95 R3.1
N$14
  Top 0.508: L2.1 14.04,18.59 14.04,20.34 IC5.4
N$17
  Top 0.508: R4.2 15.95,32.9 IC1.5
N$18
  Top 0.508: IC1.2 21.01,35.61 21.64,34.98 21.64,33.07 21.01,32.44 R4.1
OPAMP1-
  Top 0.406: IC3.2 37.09,28.25
  Top 0.508: 37.09,28.25 37.19,28.35 37.19,28.96 38.1,29.87 D3.A 39.93,29.87 40.54,29.26 40.54,25.06 R7.2
OPAMP1OUT
  Top 0.406: IC3.1 38.5,27.6
  Top 0.508: 38.5,27.6 D4.A
OPAMP2+
  Top 0.406: IC3.5 29.2,29.55
  Top 0.508: R8.2 32.84,31.41 R9.2 29.76,31.41 C3.1 29.2,29.55
OPAMP2-
  Top 0.406: IC3.6 R10.1
  Top 0.508: R10.1
PIN1
  Top 0.508: SV4.1 64.01,29.92 64.01,31.7 66.14,33.83 76.81,33.83 78.51,32.13 IC4.9
PIN2
  Top 0.508: SV4.2 66.04,27.33 67.67,28.96 67.67,31.7 68.28,32.31 75.89,32.31 77.24,30.96 IC4.10
PIN3
  Top 0.508: IC4.17 68.15,23.9 67.26,24.79 SV4.3
PIN4
  Top 0.508: IC4.23 68.76,16.28 68.58,16.46 68.58,21.03 67.36,22.25 SV4.4
PIN5
  Top 0.508: SV4.5 66.55,19.71 67.36,18.9 67.36,15.85 68.2,15.01 IC4.24
PIN6
  Top 0.508: SV4.6 65.73,17.17 66.14,16.76 66.14,15.54 67.67,14.02 67.97,14.02 68.28,13.72 68.28,10.36 69.19,9.45 72.54,9.45 73.43,10.34 IC4.26
PIN7
  Top 0.508: IC4.28 75.97,9.83 74.37,8.23 67.36,8.23 66.45,9.14 66.45,13.11 64.92,14.63 SV4.7
PIN8
  Top 0.508: SV4.8 64.01,12.04 64.01,8.84 65.84,7.01 77.11,7.01 79.78,9.68 IC4.31
RX
  Top 0.508: SV3.2 82.75,8.38 83.59,9.22 IC4.34
SCL
  Top 0.508: SV1.2 SV7.2 53.54,18.49 52.73,17.68 52.73,13.11 61.87,3.96 77.42,3.96 78.94,2.44 85.65,2.44 86.56,3.35 86.56,9.75 86.13,10.19 IC4.36
SDA
  Top 0.508: SV7.1 SV1.1 59.44,10.97 64.92,5.49 77.72,5.49 82.32,10.08 IC4.33
TX
  Top 0.508: IC4.35 84.86,9.63 85.29,9.2 SV3.3
VDD
  Top 0.508: U1.4 35.49,21.15 C2.1
VH
  Top 0.508: C7.1 13.59,26.49 15.31,24.77 IC5.3 15.29,24.09 14.01,24.09 | IC5.1 17.21,23 17.07,22.86 15.24,22.86 14.01,24.09 | 14.01,24.09 S1.3

### Text on the board
tPlace: BOOT | Helpful Hallway | EN | authors: | Wauters Thomas / De Block Pieter / Baele Tuur / Sehovic Rijad